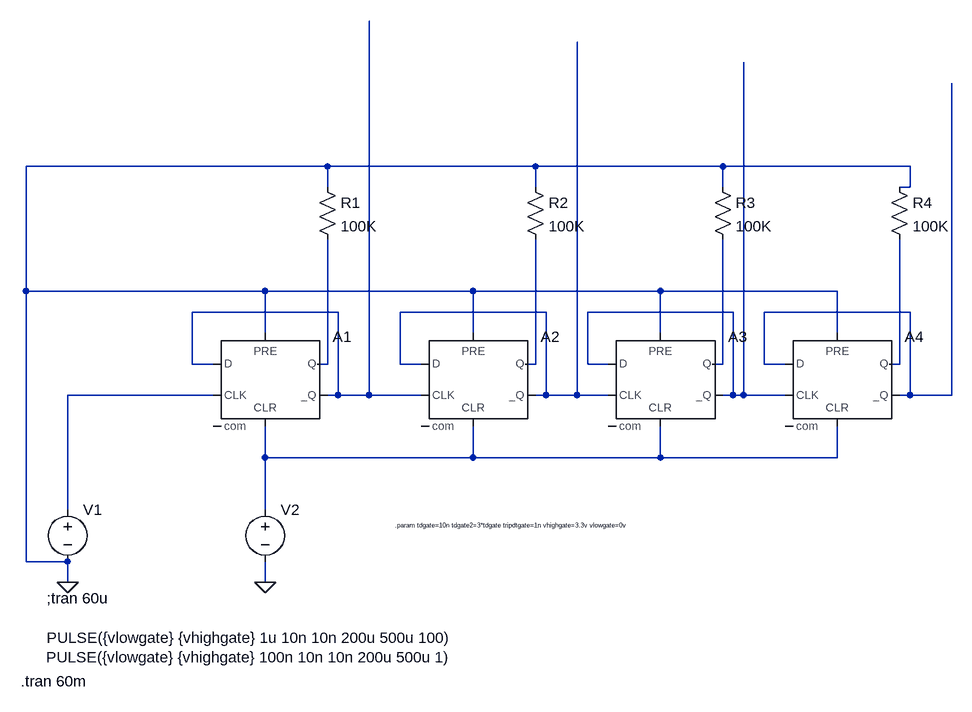
[diagram p0: schematic couner.asc]
couner.asc, the LTspice schematic file:
Version 4
SHEET 1 1204 680
WIRE 48 -256 -416 -256
WIRE 368 -256 48 -256
WIRE 656 -256 368 -256
WIRE 944 -256 656 -256
WIRE 48 -224 48 -256
WIRE 368 -224 368 -256
WIRE 656 -224 656 -256
WIRE 944 -224 944 -256
WIRE 944 -224 928 -224
WIRE -416 -64 -416 -256
WIRE -48 -64 -416 -64
WIRE 272 -64 -48 -64
WIRE 560 -64 272 -64
WIRE 832 -64 560 -64
WIRE 64 -32 -160 -32
WIRE 384 -32 160 -32
WIRE 672 -32 448 -32
WIRE 944 -32 720 -32
WIRE -48 0 -48 -64
WIRE 272 0 272 -64
WIRE 560 0 560 -64
WIRE 832 0 832 -64
WIRE -160 48 -160 -32
WIRE -128 48 -160 48
WIRE 48 48 48 -144
WIRE 48 48 32 48
WIRE 160 48 160 -32
WIRE 192 48 160 48
WIRE 368 48 368 -144
WIRE 368 48 352 48
WIRE 448 48 448 -32
WIRE 480 48 448 48
WIRE 656 48 656 -144
WIRE 656 48 640 48
WIRE 720 48 720 -32
WIRE 752 48 720 48
WIRE 928 48 928 -144
WIRE 928 48 912 48
WIRE -128 96 -352 96
WIRE 64 96 64 -32
WIRE 64 96 48 96
WIRE 112 96 112 -480
WIRE 112 96 64 96
WIRE 192 96 112 96
WIRE 384 96 384 -32
WIRE 384 96 368 96
WIRE 432 96 432 -448
WIRE 432 96 384 96
WIRE 480 96 432 96
WIRE 672 96 672 -32
WIRE 672 96 656 96
WIRE 688 96 688 -416
WIRE 688 96 672 96
WIRE 752 96 688 96
WIRE 944 96 944 -32
WIRE 944 96 928 96
WIRE 1008 96 1008 -384
WIRE 1008 96 944 96
WIRE -48 192 -48 144
WIRE 272 192 272 144
WIRE 272 192 -48 192
WIRE 560 192 560 144
WIRE 560 192 272 192
WIRE 832 192 832 144
WIRE 832 192 560 192
WIRE -352 272 -352 96
WIRE -48 272 -48 192
WIRE -416 352 -416 -64
WIRE -352 352 -416 352
WIRE -352 384 -352 352
WIRE -48 384 -48 352
FLAG -48 384 0
FLAG -352 384 0
SYMBOL Digital\\dflop -48 0 R0
WINDOW 3 0 0 Invisible 2
SYMATTR Value td={tdgate2} tripdt={tripdtgate} vhigh={vhighgate} vlow={vlowgate}
SYMATTR InstName A1
SYMBOL Digital\\dflop 272 0 R0
WINDOW 3 0 0 Invisible 2
SYMATTR Value td={tdgate2} tripdt={tripdtgate} vhigh={vhighgate} vlow={vlowgate}
SYMATTR InstName A2
SYMBOL Digital\\dflop 560 0 R0
WINDOW 3 0 0 Invisible 2
SYMATTR Value td={tdgate2} tripdt={tripdtgate} vhigh={vhighgate} vlow={vlowgate}
SYMATTR InstName A3
SYMBOL Digital\\dflop 832 0 R0
WINDOW 3 0 0 Invisible 2
SYMATTR Value td={tdgate2} tripdt={tripdtgate} vhigh={vhighgate} vlow={vlowgate}
SYMATTR InstName A4
SYMBOL voltage -352 256 R0
WINDOW 3 -32 213 Left 2
WINDOW 123 0 0 Left 2
WINDOW 39 0 0 Left 2
SYMATTR Value PULSE({vlowgate} {vhighgate} 1u 10n 10n 200u 500u 100)
SYMATTR InstName V1
SYMBOL voltage -48 256 R0
WINDOW 3 -337 243 Left 2
WINDOW 123 0 0 Left 2
WINDOW 39 0 0 Left 2
SYMATTR Value PULSE({vlowgate} {vhighgate} 100n 10n 10n 200u 500u 1)
SYMATTR InstName V2
SYMBOL res 32 -240 R0
SYMATTR InstName R1
SYMATTR Value 100K
SYMBOL res 352 -240 R0
SYMATTR InstName R2
SYMATTR Value 100K
SYMBOL res 640 -240 R0
SYMATTR InstName R3
SYMATTR Value 100K
SYMBOL res 912 -240 R0
SYMATTR InstName R4
SYMATTR Value 100K
TEXT -384 408 Left 2 !;tran 60u
TEXT 152 296 Left 0 !.param tdgate=10n tdgate2=3*tdgate tripdtgate=1n vhighgate=3.3v vlowgate=0v
TEXT -424 536 Left 2 !.tran 60m

The netlist it stands for:
* couner.asc
A1 N001 0 N009 0 N010 N001 N005 0 DFLOP td={tdgate2} tripdt={tripdtgate} vhigh={vhighgate} vlow={vlowgate}
A2 N002 0 N001 0 N010 N002 N006 0 DFLOP td={tdgate2} tripdt={tripdtgate} vhigh={vhighgate} vlow={vlowgate}
A3 N003 0 N002 0 N010 N003 N007 0 DFLOP td={tdgate2} tripdt={tripdtgate} vhigh={vhighgate} vlow={vlowgate}
A4 N004 0 N003 0 N010 N004 N008 0 DFLOP td={tdgate2} tripdt={tripdtgate} vhigh={vhighgate} vlow={vlowgate}
V1 N009 0 PULSE({vlowgate} {vhighgate} 1u 10n 10n 200u 500u 100)
V2 N010 0 PULSE({vlowgate} {vhighgate} 100n 10n 10n 200u 500u 1)
R1 0 N005 100K
R2 0 N006 100K
R3 0 N007 100K
R4 0 N008 100K
;tran 60u
.param tdgate=10n tdgate2=3*tdgate tripdtgate=1n vhighgate=3.3v vlowgate=0v
.tran 60m
.backanno
.end